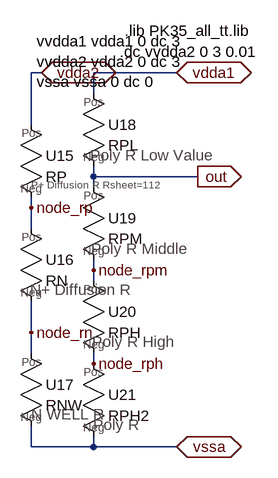
[diagram p0: schematic r2r.asc]
r2r.asc, the LTspice schematic file:
Version 4
SHEET 1 1188 680
WIRE -144 -112 -160 -112
WIRE 64 -112 -64 -112
WIRE -64 -80 -64 -112
WIRE -160 -32 -160 -112
WIRE -64 48 -64 32
WIRE 96 48 -64 48
WIRE -64 64 -64 48
WIRE -160 96 -160 80
WIRE -160 128 -160 96
WIRE -64 192 -64 176
WIRE -64 208 -64 192
WIRE -160 288 -160 240
WIRE -160 320 -160 288
WIRE -64 336 -64 320
WIRE -160 464 -160 432
WIRE -64 464 -64 448
WIRE -64 464 -160 464
WIRE 64 464 -64 464
FLAG 64 -112 vdda1
IOPIN 64 -112 BiDir
FLAG 64 464 vssa
IOPIN 64 464 BiDir
FLAG 96 48 out
IOPIN 96 48 Out
FLAG -160 288 node_rn
FLAG -64 192 node_rpm
FLAG -64 336 node_rph
FLAG -144 -112 vdda2
IOPIN -144 -112 BiDir
FLAG -160 96 node_rp
SYMBOL RP -160 16 R0
SYMATTR InstName U15
SYMBOL RN -160 176 R0
SYMATTR InstName U16
SYMBOL RNW -160 368 R0
SYMATTR InstName U17
SYMATTR SpiceLine L=10u W=10u
SYMBOL RPL -64 -32 R0
SYMATTR InstName U18
SYMATTR SpiceLine l=400u w=10u
SYMBOL RPM -64 112 R0
SYMATTR InstName U19
SYMBOL RPH -64 256 R0
SYMATTR InstName U20
SYMATTR SpiceLine l=20u w=10u
SYMBOL RPH2 -64 384 R0
SYMATTR InstName U21
SYMATTR SpiceLine l=10u W=10u
TEXT -152 -160 Left 2 !vvdda1 vdda1 0 dc 3\nvvdda2 vdda2 0 dc 3\nvssa vssa 0 dc 0
TEXT -24 -144 Left 2 !.dc vvdda2 0 3 0.01
TEXT -16 -176 Left 2 !.lib PK35_all_tt.lib

The netlist it stands for:
* r2r.asc
XU15 vdda2 node_rp RP L=100u W=10u  ; pins Pos Neg
XU16 node_rp node_rn RN L=100u W=10u  ; pins Pos Neg
XU17 node_rn vssa RNW L=10u W=10u  ; pins Pos Neg
XU18 vdda1 out RPL l=400u w=10u  ; pins Pos Neg
XU19 out node_rpm RPM L=100u W=10u  ; pins Pos Neg
XU20 node_rpm node_rph RPH l=20u w=10u  ; pins Pos Neg
XU21 node_rph vssa RPH2 l=10u W=10u  ; pins Pos Neg
vvdda1 vdda1 0 dc 3
vvdda2 vdda2 0 dc 3
vssa vssa 0 dc 0
.dc vvdda2 0 3 0.01
.lib PK35_all_tt.lib
.backanno
.end